# Altium schematic sheet OZ440-SE100-CAR003_sheet14.SchDoc
size A3
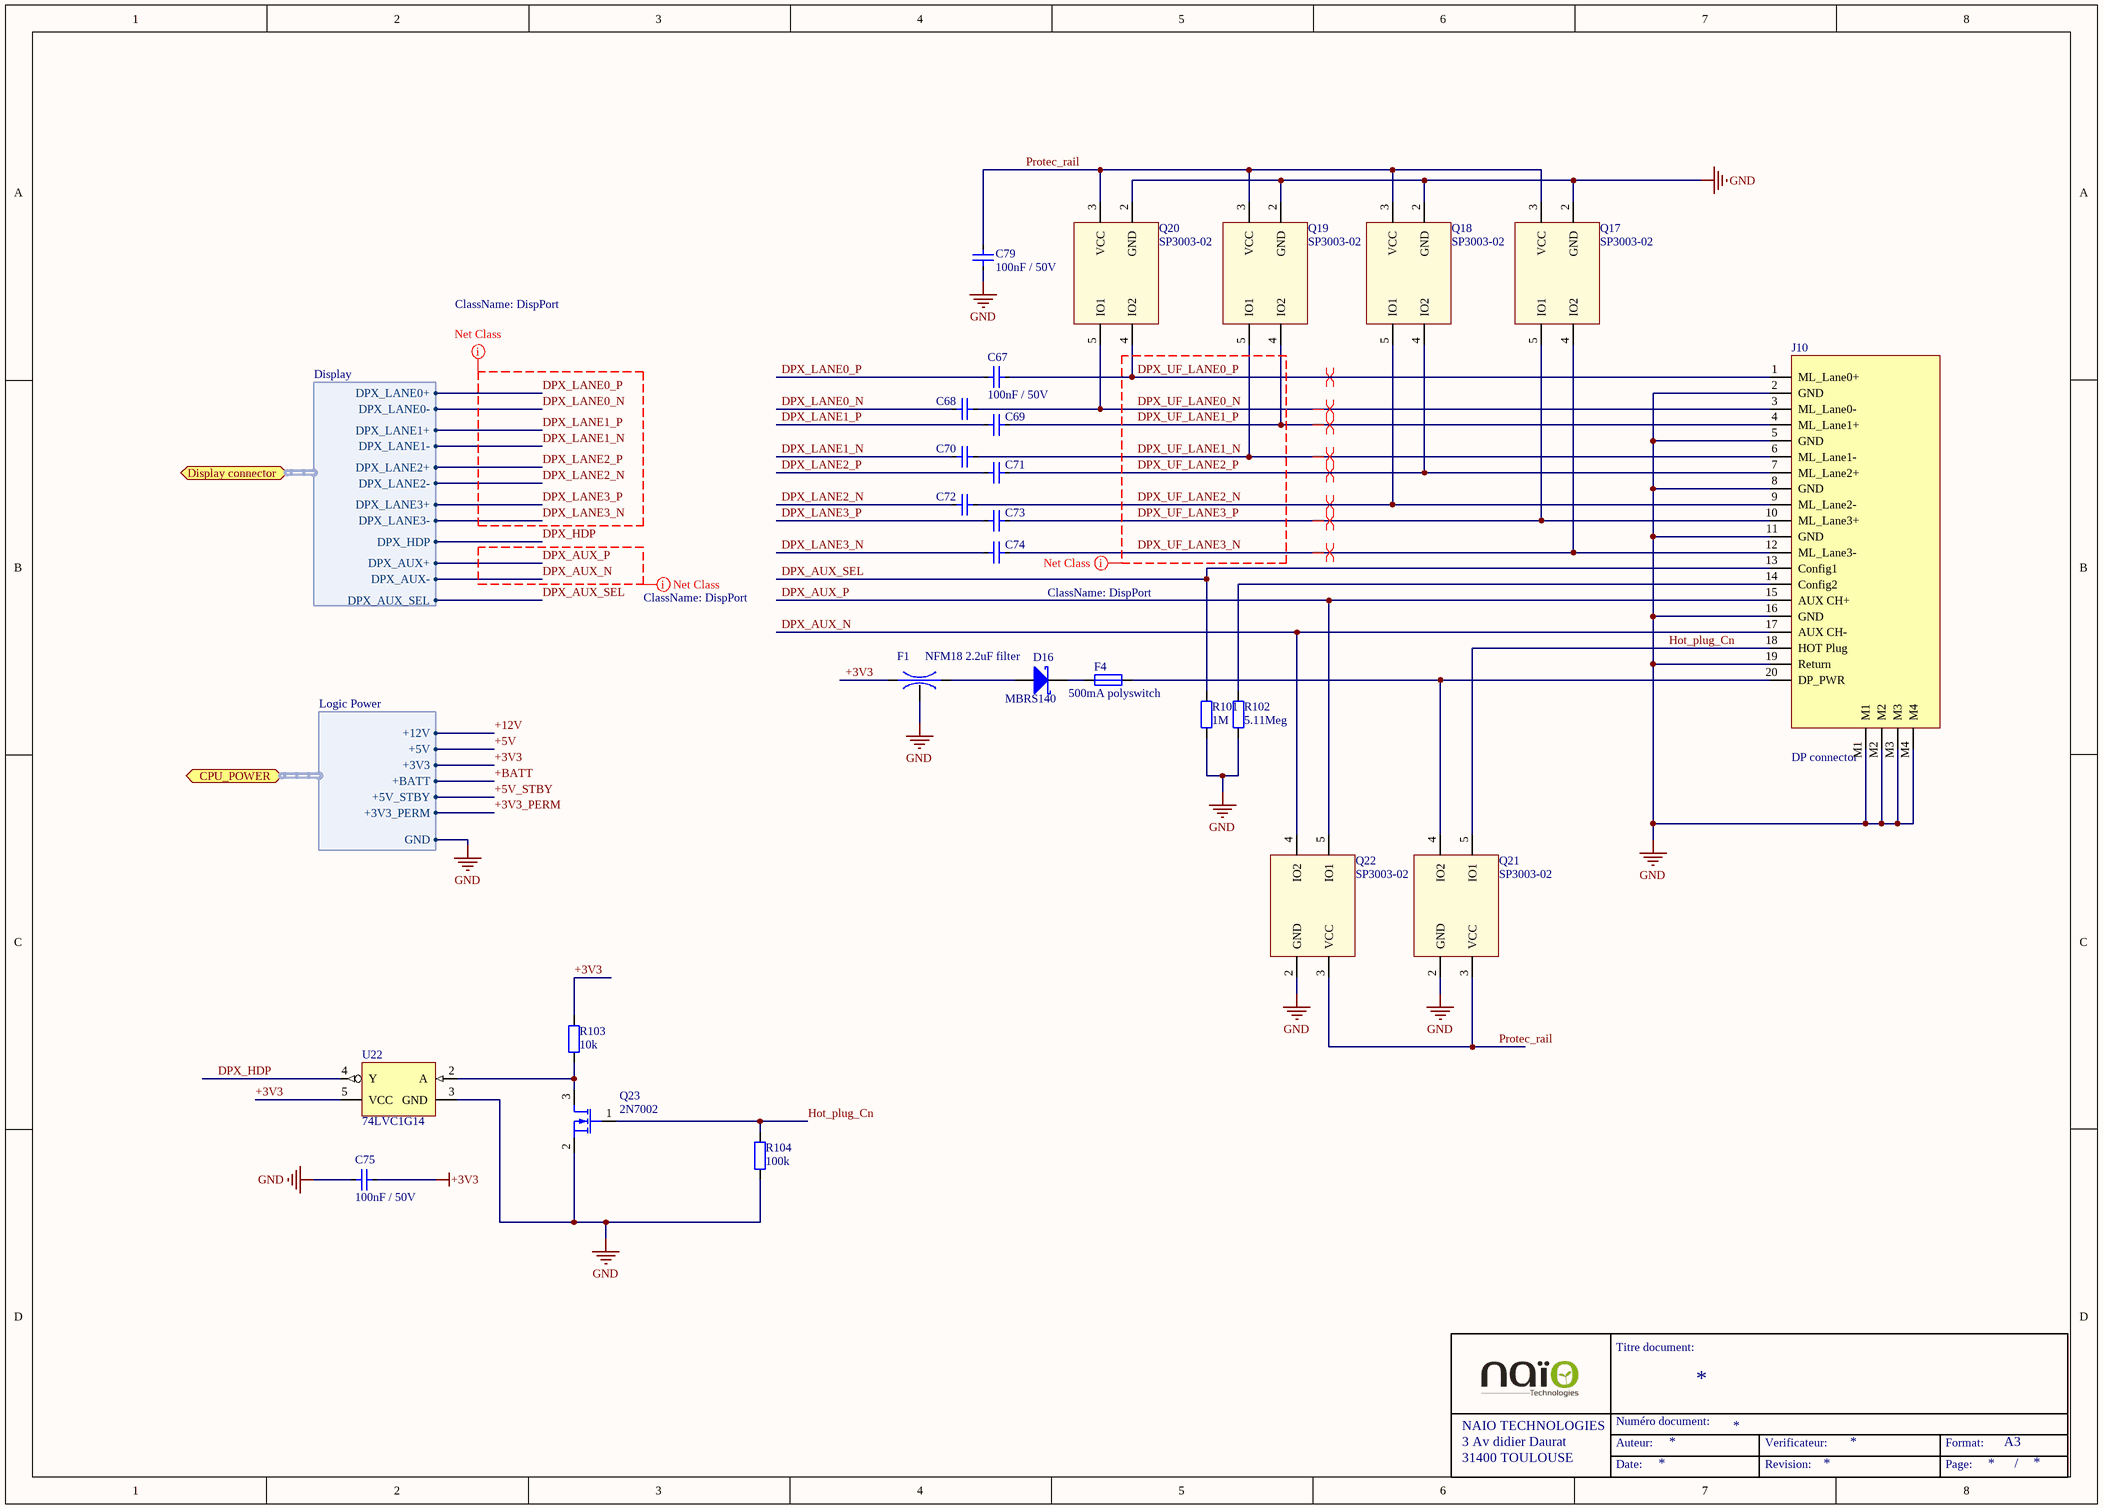
[diagram p0: OZ440-SE100-CAR003_sheet14.SchDoc]

## Parts
C67  Displayed reference: 100nF / 50V  [C0805-STD]  (hidden comment: CAP-SMD)
C68  CAP-SMD  [C0805-STD]  (value not drawn)
C69  CAP-SMD  [C0805-STD]  (value not drawn)
C70  CAP-SMD  [C0805-STD]  (value not drawn)
C71  CAP-SMD  [C0805-STD]  (value not drawn)
C72  CAP-SMD  [C0805-STD]  (value not drawn)
C73  CAP-SMD  [C0805-STD]  (value not drawn)
C74  CAP-SMD  [C0805-STD]  (value not drawn)
C75  Displayed reference: 100nF / 50V  [C0805-STD]  (hidden comment: CAP-SMD)
C79  Displayed reference: 100nF / 50V  [C0805-STD]  (hidden comment: CAP-SMD)
D16  Displayed reference: MBRS140  [DO214AA-STD]  (hidden comment: DIODE_SCHOTKY-DO214AA)
F1  Displayed reference: NFM18 2.2uF filter  [LC_0603-STD]  (hidden comment: LC_FILTER-STD)
F4  Displayed reference: 500mA polyswitch  [R0805-STD]  (hidden comment: FUSE-SMD)
J10  Displayed reference: DP connector  [CONN-SPE-DISPLAY_PORT_DP1RD20JQ1R400_JAE]  (hidden comment: CONN-STD-DISPLAY_PORT_B)
Q17  Displayed reference: SP3003-02  [SC70-SPE-SP3003]  (hidden comment: SP03003_02-SC70)
Q18  Displayed reference: SP3003-02  [SC70-SPE-SP3003]  (hidden comment: SP03003_02-SC70)
Q19  Displayed reference: SP3003-02  [SC70-SPE-SP3003]  (hidden comment: SP03003_02-SC70)
Q20  Displayed reference: SP3003-02  [SC70-SPE-SP3003]  (hidden comment: SP03003_02-SC70)
Q21  Displayed reference: SP3003-02  [SC70-SPE-SP3003]  (hidden comment: SP03003_02-SC70)
Q22  Displayed reference: SP3003-02  [SC70-SPE-SP3003]  (hidden comment: SP03003_02-SC70)
Q23  Displayed reference: 2N7002  [SOT23-SPE-2N7002]  (hidden comment: 2N7002-SMD3P)
R101  Displayed reference: 1M  [R0805-STD]  (hidden comment: RES-SMD)
R102  Displayed reference: 5.11Meg  [R0805-STD]  (hidden comment: RES-SMD)
R103  Displayed reference: 10k  [R0805-STD]  (hidden comment: RES-SMD)
R104  Displayed reference: 100k  [R0805-STD]  (hidden comment: RES-SMD)
U22  Displayed reference: 74LVC1G14  [SOT353-1_5pin-STD]  (hidden comment: 74xxx1G14GW-SOT353-1)

## Ports
CPU_POWER (harness Logic Power), Display connector (harness Display)

## Harnesses
Display: DPX_LANE0+, DPX_LANE0-, DPX_LANE1+, DPX_LANE1-, DPX_LANE2+, DPX_LANE2-, DPX_LANE3+, DPX_LANE3-, DPX_HDP, DPX_AUX+, DPX_AUX-, DPX_AUX_SEL
Logic Power: +12V, +5V, +3V3, +BATT, +5V_STBY, GND, +3V3_PERM

## Nets
+3V3: C75.2 F1.1(A) R103.2 U22.5(VCC) ; port CPU_POWER.+3V3
GND: C75.1 C79.1 F1.3(G) J10.2(GND) J10.5(GND) J10.8(GND) J10.11(GND) J10.16(GND) J10.19(Return) J10.M1 J10.M2 J10.M3 J10.M4 Q17.2(GND) Q18.2(GND) Q19.2(GND) Q20.2(GND) Q21.2(GND) Q22.2(GND) Q23.2(S) R101.1 R102.1 R104.1 U22.3(GND) ; port CPU_POWER.GND
+3V3_PERM: port CPU_POWER.+3V3_PERM
+5V: port CPU_POWER.+5V
+5V_STBY: port CPU_POWER.+5V_STBY
+12V: port CPU_POWER.+12V
+BATT: port CPU_POWER.+BATT
DPX_AUX_N: J10.17(AUX_CH-) Q22.4(IO2) ; port Display connector.DPX_AUX-
DPX_AUX_P: J10.15(AUX_CH+) Q22.5(IO1) ; port Display connector.DPX_AUX+
DPX_AUX_SEL: J10.13(Config1) R101.2 ; port Display connector.DPX_AUX_SEL
DPX_HDP: U22.4(Y) ; port Display connector.DPX_HDP
DPX_LANE0_N: C68.2 ; port Display connector.DPX_LANE0-
DPX_LANE0_P: C67.2 ; port Display connector.DPX_LANE0+
DPX_LANE1_N: C70.2 ; port Display connector.DPX_LANE1-
DPX_LANE1_P: C69.2 ; port Display connector.DPX_LANE1+
DPX_LANE2_N: C72.2 ; port Display connector.DPX_LANE2-
DPX_LANE2_P: C71.2 ; port Display connector.DPX_LANE2+
DPX_LANE3_N: C74.2 ; port Display connector.DPX_LANE3-
DPX_LANE3_P: C73.2 ; port Display connector.DPX_LANE3+
DPX_UF_LANE0_N: C68.1 J10.3(ML_Lane0-) Q20.5(IO1)
DPX_UF_LANE0_P: C67.1 J10.1(ML_Lane0+) Q20.4(IO2)
DPX_UF_LANE1_N: C70.1 J10.6(ML_Lane1-) Q19.5(IO1)
DPX_UF_LANE1_P: C69.1 J10.4(ML_Lane1+) Q19.4(IO2)
DPX_UF_LANE2_N: C72.1 J10.9(ML_Lane2-) Q18.5(IO1)
DPX_UF_LANE2_P: C71.1 J10.7(ML_Lane2+) Q18.4(IO2)
DPX_UF_LANE3_N: C74.1 J10.12(ML_Lane3-) Q17.4(IO2)
DPX_UF_LANE3_P: C73.1 J10.10(ML_Lane3+) Q17.5(IO1)
Hot_plug_Cn: J10.18(HOT_Plug) Q21.5(IO1) Q23.1(G) R104.2
Protec_rail: C79.2 Q17.3(VCC) Q18.3(VCC) Q19.3(VCC) Q20.3(VCC) Q21.3(VCC) Q22.3(VCC)
NetD16_A: D16.A F1.2(B)
NetD16_K: D16.K F4.1
NetF4_2: F4.2 J10.20(DP_PWR) Q21.4(IO2)
NetJ10_14: J10.14(Config2) R102.2
NetQ23_3: Q23.3(D) R103.1 U22.2(A)

## Layout directives
net class DispPort: DPX_AUX_N, DPX_AUX_P, DPX_LANE0_N, DPX_LANE0_P, DPX_LANE1_N, DPX_LANE1_P, DPX_LANE2_N, DPX_LANE2_P, DPX_LANE3_N, DPX_LANE3_P, DPX_UF_LANE0_N, DPX_UF_LANE0_P, DPX_UF_LANE1_N, DPX_UF_LANE1_P, DPX_UF_LANE2_N, DPX_UF_LANE2_P, DPX_UF_LANE3_N, DPX_UF_LANE3_P
differential pair: DPX_UF_LANE0_N, DPX_UF_LANE0_P, DPX_UF_LANE1_N, DPX_UF_LANE1_P, DPX_UF_LANE2_N, DPX_UF_LANE2_P, DPX_UF_LANE3_N, DPX_UF_LANE3_P

## Notes on the sheet
- Titre document:
- NAIO TECHNOLOGIES
- 3 Av didier Daurat
- 31400 TOULOUSE
- Auteur:
- Numéro document:
- Verificateur:
- Format:
- A3
- Date:
- Revision:
- Page:
- /

## Library data of the parts
C67-C75 C79 = VJ0805Y104KXAxx: 0805 100nF / 50V  X7R ceramic capacitor; Manufacturer: vishay; Max Voltage: 50; Tolerance: +/- 10%; Validated: N; Reference: VJ0805Y104KXAxx; Value: 100nF; Material: X7R; Footprint description: standard Capacitor 0805; Pin Count: 2; helpURL: http://www.vishay.com/docs/45200/highrels.pdf; Supplier 1: Farnell; Supplier Part Number 1: 1612208; Supplier 2: Digi-Key; Supplier Part Number 2: 720-1266-6-ND
  C68-C74: Displayed reference: 100nF / 50V
D16 = MBRS140: 1A/40V shottky diode in SMB package; Manufacturer: FAIRCHILD; Max Voltage: 40V; Max Current: 1A; Rated Power: 0.6W; Validated: False; Reference: MBRS140; component type: DIODE; Footprint description: DO-214AA SMD footprint; Pin Count: 2; Rev: B2; helpURL: http://www.fairchildsemi.com/ds/MB/MBRS140.pdf; Supplier 1: Farnell; Supplier Part Number 1: 1467526; Supplier 2: Digi-Key; Supplier Part Number 2: MBRS140FSCT-ND
F1 = NFM18PC225B0J3: 2A LC filter; Manufacturer: MURATA; Max Voltage: 6.3; Frequency band: 0-20Mhz; Validated: False; Reference: NFM18PC225B0J3; Max Current: 2A; Footprint description: standard 0603 filter package; Pin Count: 3; Rev: 2/11/2011; helpURL: http://www.murata.com/products/emc/application/pdf/EMIAPDCE_2.pdf; Supplier 1: Digi-Key; Supplier Part Number 1: NFM18PC225B0J3D-ND; Supplier 2: Mouser; Supplier Part Number 2: 81-NFM18PC225B0J3D
F4 = MF-PSMF050X-2: 0805 500mA resettable fuse; Manufacturer: BOURNS; Validated: False; Reference: MF-PSMF050X-2; Max Current: 500mA; Pin Count: 2; helpURL: http://www.farnell.com/datasheets/1442129.pdf; Supplier 1: Farnell; Supplier Part Number 1: 1294876; Supplier 2: Mouser; Supplier Part Number 2: 652-MF-PSMF050X-2
J10 = DP1RD20JQ1: Display port PCB connector; Manufacturer: JAE; Validated: False; Reference: DP1RD20JQ1; Footprint description: SMD Display port PCB connector; Pin Count: 20; Rev: 10/08; helpURL: http://jae-connector.com/en/pdf/MB-0192-1E_DP1.pdf; Supplier 1: Farnell; Supplier Part Number 1: 2057447; Supplier 2: Mouser; Supplier Part Number 2: 656-DP1RD20JQ1R400
Q17-Q22 = SP3003-02JTG: Low capacitance ESD TVS; Manufacturer: LITTLEFUSE; Max Voltage: 8V; Reference: SP3003-02JTG; component type: DIODE; Footprint description: SC70; Pin Count: 5; Rev: 20/08/13; helpURL: http://www.littelfuse.com/~/media/electronics/datasheets/tvs_diode_arrays/littelfuse_tvs_diode_array_sp3003_datasheet.pdf.pdf; Supplier 1: Farnell; Supplier Part Number 1: 2369568; Supplier 2: Mouser; Supplier Part Number 2: 576-SP3003-02JTG
Q23 = 2N7002: N-Channel Enhancement Mode Field Effect Transistor; Manufacturer: FAIRCHILD; Max Voltage: 60 V; Max Current: 0,4 A; Rated Power: 0,2 W; Validated: False; Reference: 2N7002; component type: NMOS; Footprint description: SOT23; Pin Count: 3; Rev: A1; helpURL: http://www.fairchildsemi.com/ds/2N/2N7000.pdf; Supplier 1: Farnell; Supplier Part Number 1: 9845313; Supplier 2: Newark; Supplier Part Number 2: 58K9651
R101 = CRCW08051M00FKxx: 1Mohm 1% 0805 SMD resistor; Manufacturer: Vishay; Value: 1000000; Rated Power: 0.125W; Validated: False; Reference: CRCW08051M00FKxx; Tolerance: 1%; Footprint description: standard 0805 SMD; Pin Count: 2; helpURL: http://www.vishay.com/docs/20035/dcrcwe3.pdf; Supplier 1: Farnell; Supplier Part Number 1: 2413580; Supplier 2: Mouser; Supplier Part Number 2: 71-CRCW08051M00FKEB
R102 = CRCW08055M11FKxx: 5.11Meg Ohm 0805 SMD resistor; Manufacturer: Vishay; Value: 5 110 000; Tolerance: 1%; Rated Power: 0.125W; Validated: No; Reference: CRCW08055M11FKxx; Footprint description: standard 0805 SMD; Pin Count: 2; helpURL: http://www.vishay.com/docs/20035/dcrcwe3.pdf; Supplier 1: Farnell; Supplier Part Number 1: 1152416; Supplier 2: Mouser; Supplier Part Number 2: 71-CRCW0805-5.11M-E3
R103 = CRCW080510K0FKxx: 10k Ohm 0805 SMD resistor; Manufacturer: Vishay; Value: 10 000; Tolerance: 1 %; Rated Power: 0,125 W; Validated: No; Reference: CRCW080510K0FKxx; Footprint description: standard 0805 SMD; Pin Count: 2; helpURL: http://www.vishay.com/docs/20035/dcrcwe3.pdf; Supplier 1: Farnell; Supplier Part Number 1: 1469856; Supplier 2: Mouser; Supplier Part Number 2: 71-CRCW0805-10K-E3
R104 = CRCW0805100KFKxx: 100k Ohm 0805 SMD resistor; Manufacturer: Vishay; Value: 100 000; Tolerance: 1 %; Rated Power: 0,125 W; Validated: No; Reference: CRCW0805100KFKxx; Footprint description: standard 0805 SMD; Pin Count: 2; helpURL: http://www.vishay.com/docs/20035/dcrcwe3.pdf; Supplier 1: Farnell; Supplier Part Number 1: 1469860; Supplier 2: Mouser; Supplier Part Number 2: 71-CRCW0805-100K-E3
U22 = 74LVC1G14GW: smith trigger inverter; Manufacturer: NXP; Max Voltage: 5,5V; Validated: False; Reference: 74LVC1G14GW; Footprint description: SOT353-1, 5 pin; Pin Count: 5; helpURL: http://www.nxp.com/documents/data_sheet/74LVC1G14.pdf; Supplier 1: Farnell; Supplier Part Number 1: 1631687; Supplier 2: Digi-Key; Supplier Part Number 2: 568-2267-1-ND